# Altium project TemperatureController.PrjPcb (part 1 of 4)
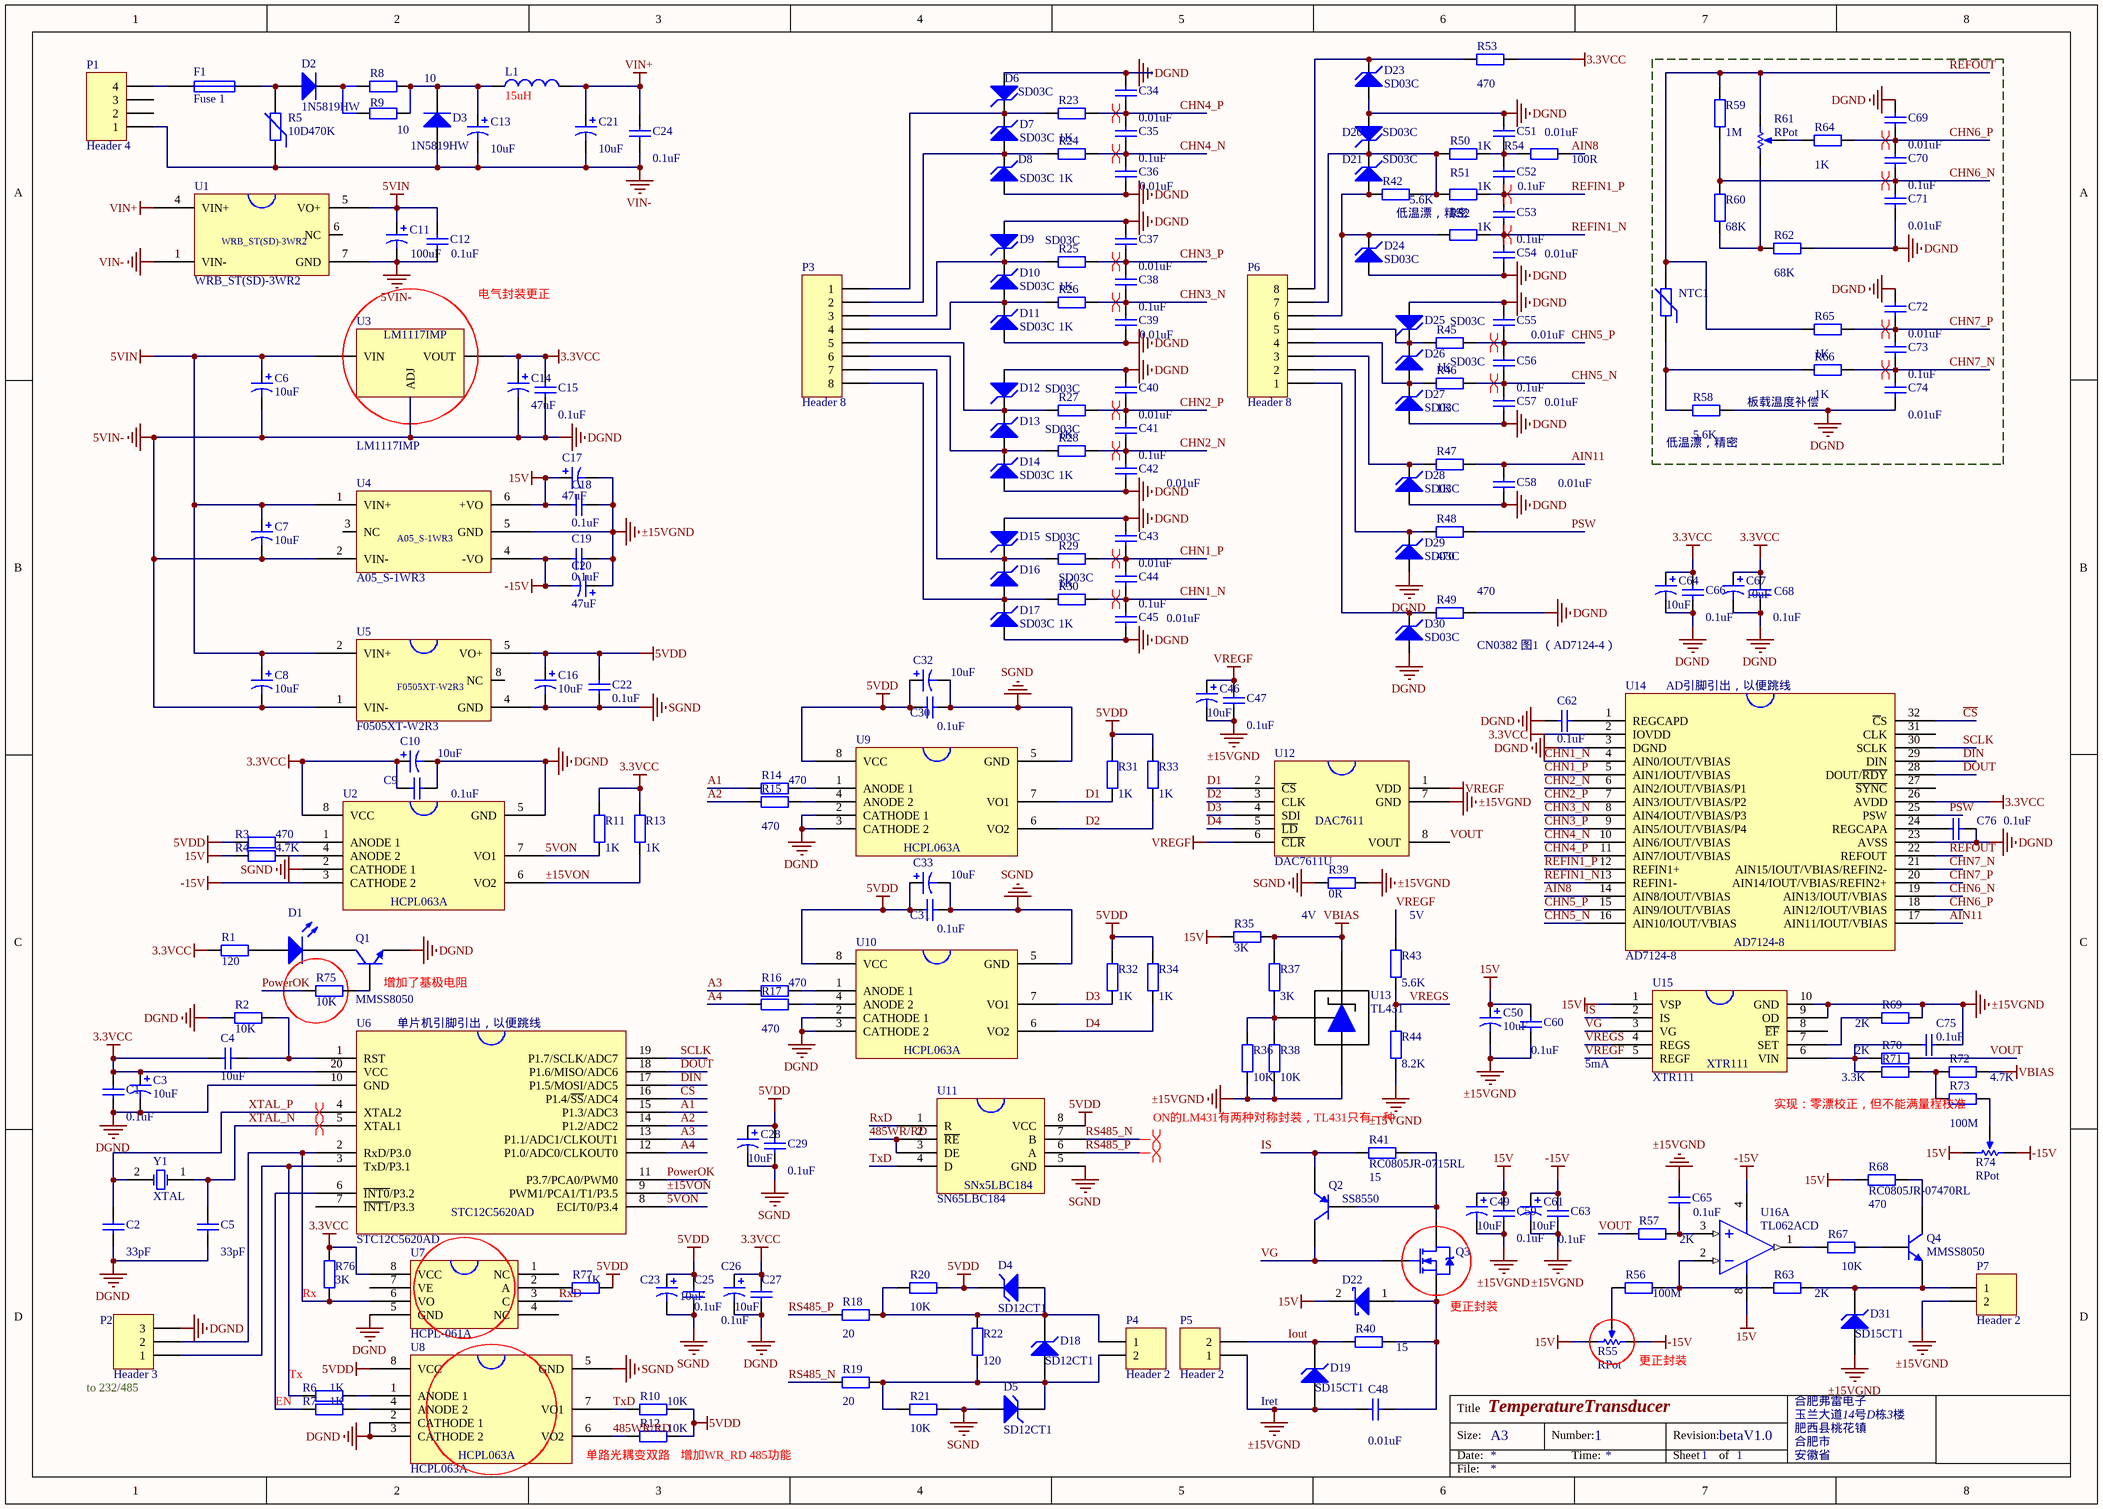
[diagram p0: betaV1.0.SchDoc]
18 sheets, 1029 parts. Net scope: hierarchical (ports join the sheet entries above them; power ports are global).
Board file: betaV1.0.PcbDoc
Sheets:
  betaV1.0.SchDoc
  dac.SchDoc
  relays.SchDoc
  rs485.SchDoc
  hmi.SchDoc
  iout.SchDoc
  viout.SchDoc
  infopage.SchDoc
    U_vioutchn1 = vioutchn1.SchDoc
    U_vioutchn2 = vioutchn2.SchDoc
    U_vioutchn3 = vioutchn3.SchDoc
    U_vioutchn4 = vioutchn4.SchDoc
    U_vioutchn5 = vioutchn5.SchDoc
    U_vioutchn6 = vioutchn6.SchDoc
    U_vioutchn7 = vioutchn7.SchDoc
    U_vioutchn8 = vioutchn8.SchDoc
    U_power = power.SchDoc
    U_mcu = mcu.SchDoc

## Sheet betaV1.0.SchDoc: TemperatureTransducer
size A3; Author: wq; DrawnBy: wq; Organization: 合肥弗雷电子; Address1: 玉兰大道14号D栋3楼; Address2: 肥西县桃花镇; Address3: 合肥市; Address4: 安徽省; DocumentNumber: 1; Revision: betaV1.0; SheetNumber: 1; SheetTotal: 1

### Parts
(Parts that share a designator on the sheet are numbered #1, #2 ... from top to bottom, then left to right.)
C1#1  value 0.1uF  [0805c]  (hidden comment: CC0805MRX7R9BB104)
C2#1  value 33pF  [0805c]  (hidden comment: CC0805MRX7R9BB330)
C3#1  value 10uF  [CB]  (hidden comment: T494B106M006AHAUTO)
C4#1  value 10uF  [0805c]  (hidden comment: CC0805MRX7R9BB106)
C5#1  value 33pF  [0805c]  (hidden comment: CC0805MRX7R9BB330)
C6#1  value 10uF  [CB]  (hidden comment: T494B106M006AHAUTO)
C7#1  value 10uF  [CB]  (hidden comment: T494B106M006AHAUTO)
C8#1  value 10uF  [CB]  (hidden comment: T494B106M006AHAUTO)
C9#1  value 0.1uF  [0805c]  (hidden comment: CC0805MRX7R9BB104)
C10#1  value 10uF  [CB]  (hidden comment: T494B106M006AHAUTO)
C11#1  value 100uF  [CB]  (hidden comment: T494B107M006AHAUTO)
C12#1  value 0.1uF  [0805c]  (hidden comment: CC0805MRX7R9BB104)
C13#1  value 10uF  [Φ6.3×11.5]  (hidden comment: ECR1HQG100M-063007)
C14#1  value 47uF  [CB]  (hidden comment: T494B476M010AHAUTO)
C15#1  value 0.1uF  [0805c]  (hidden comment: CC0805MRX7R9BB104)
C16#1  value 10uF  [CB]  (hidden comment: T494B106M006AHAUTO)
C17#1  value 47uF  [CB]  (hidden comment: T494B476K025ATAUTO)
C18#1  value 0.1uF  [0805c]  (hidden comment: CC0805MRX7R9BB104)
C19#1  value 0.1uF  [0805c]  (hidden comment: CC0805MRX7R9BB104)
C20#1  value 47uF  [CB]  (hidden comment: T494B476K025ATAUTO)
C21#1  value 10uF  [Φ6.3×11.5]  (hidden comment: ECR1HQG100M-063007)
C22#1  value 0.1uF  [0805c]  (hidden comment: CC0805MRX7R9BB104)
C23#1  value 10uF  [CB]  (hidden comment: T494B106M006AHAUTO)
C24#1  value 0.1uF  [0805c]  (hidden comment: CC0805MRX7R9BB104)
C25#1  value 0.1uF  [0805c]  (hidden comment: CC0805MRX7R9BB104)
C26#1  value 10uF  [CB]  (hidden comment: T494B106M006AHAUTO)
C27#1  value 0.1uF  [0805c]  (hidden comment: CC0805MRX7R9BB104)
C28#1  value 10uF  [CB]  (hidden comment: T494B106M006AHAUTO)
C29#1  value 0.1uF  [0805c]  (hidden comment: CC0805MRX7R9BB104)
C30#1  value 0.1uF  [0805c]  (hidden comment: CC0805MRX7R9BB104)
C31#1  value 0.1uF  [0805c]  (hidden comment: CC0805MRX7R9BB104)
C32#1  value 10uF  [CB]  (hidden comment: T494B106M006AHAUTO)
C33#1  value 10uF  [CB]  (hidden comment: T494B106M006AHAUTO)
C34#1  value 0.01uF  [0805c]  (hidden comment: CC0805MRX7R9BB103)
C35#1  value 0.1uF  [0805c]  (hidden comment: CC0805MRX7R9BB104)
C36#1  value 0.01uF  [0805c]  (hidden comment: CC0805MRX7R9BB103)
C37#1  value 0.01uF  [0805c]  (hidden comment: CC0805MRX7R9BB103)
C38#1  value 0.1uF  [0805c]  (hidden comment: CC0805MRX7R9BB104)
C39#1  value 0.01uF  [0805c]  (hidden comment: CC0805MRX7R9BB103)
C40#1  value 0.01uF  [0805c]  (hidden comment: CC0805MRX7R9BB103)
C41#1  value 0.1uF  [0805c]  (hidden comment: CC0805MRX7R9BB104)
C42#1  value 0.01uF  [0805c]  (hidden comment: CC0805MRX7R9BB103)
C43#1  value 0.01uF  [0805c]  (hidden comment: CC0805MRX7R9BB103)
C44#1  value 0.1uF  [0805c]  (hidden comment: CC0805MRX7R9BB104)
C45#1  value 0.01uF  [0805c]  (hidden comment: CC0805MRX7R9BB103)
C46#1  value 10uF  [CB]  (hidden comment: T494B106M006AHAUTO)
C47#1  value 0.1uF  [0805c]  (hidden comment: CC0805MRX7R9BB104)
C48#1  value 0.01uF  [0805c]  (hidden comment: CC0805MRX7R9BB103)
C49#1  value 10uF  [CB]  (hidden comment: T494B106M025AHAUTO)
C50#1  value 10uF  [CB]  (hidden comment: T494B106M025AHAUTO)
C51#1  value 0.01uF  [0805c]  (hidden comment: CC0805MRX7R9BB103)
C52#1  value 0.1uF  [0805c]  (hidden comment: CC0805MRX7R9BB104)
C53#1  value 0.1uF  [0805c]  (hidden comment: CC0805MRX7R9BB104)
C54#1  value 0.01uF  [0805c]  (hidden comment: CC0805MRX7R9BB103)
C55#1  value 0.01uF  [0805c]  (hidden comment: CC0805MRX7R9BB103)
C56#1  value 0.1uF  [0805c]  (hidden comment: CC0805MRX7R9BB104)
C57#1  value 0.01uF  [0805c]  (hidden comment: CC0805MRX7R9BB103)
C58#1  value 0.01uF  [0805c]  (hidden comment: CC0805MRX7R9BB103)
C59#1  value 0.1uF  [0805c]  (hidden comment: CC0805MRX7R9BB104)
C60#1  value 0.1uF  [0805c]  (hidden comment: CC0805MRX7R9BB104)
C61#1  value 10uF  [CB]  (hidden comment: T494B106M025AHAUTO)
C62#1  value 0.1uF  [0805c]  (hidden comment: CC0805MRX7R9BB104)
C63#1  value 0.1uF  [0805c]  (hidden comment: CC0805MRX7R9BB104)
C64#1  value 10uF  [CB]  (hidden comment: T494B106M006AHAUTO)
C65#1  value 0.1uF  [0805c]  (hidden comment: CC0805MRX7R9BB104)
C66#1  value 0.1uF  [0805c]  (hidden comment: CC0805MRX7R9BB104)
C67#1  value 10uF  [CB]  (hidden comment: T494B106M006AHAUTO)
C68#1  value 0.1uF  [0805c]  (hidden comment: CC0805MRX7R9BB104)
C69#1  value 0.01uF  [0805c]  (hidden comment: CC0805MRX7R9BB103)
C70#1  value 0.1uF  [0805c]  (hidden comment: CC0805MRX7R9BB104)
C71#1  value 0.01uF  [0805c]  (hidden comment: CC0805MRX7R9BB103)
C72#1  value 0.01uF  [0805c]  (hidden comment: CC0805MRX7R9BB103)
C73#1  value 0.1uF  [0805c]  (hidden comment: CC0805MRX7R9BB104)
C74#1  value 0.01uF  [0805c]  (hidden comment: CC0805MRX7R9BB103)
C75#1  value 0.1uF  [0805c]  (hidden comment: CC0805MRX7R9BB104)
C76#1  value 0.1uF  [0805c]  (hidden comment: CC0805MRX7R9BB104)
D1#1  150080GS75000  [LEDΦ3.0]  (value not drawn)
D2#1  1N5819HW  [sod123]
D3#1  1N5819HW  [sod123]
D4#1  SD12CT1  [sod323]
D5#1  SD12CT1  [sod323]
D6#1  SD03C  [sod323]
D7#1  SD03C  [sod323]
D8#1  SD03C  [sod323]
D9#1  SD03C  [sod323]
D10#1  SD03C  [sod323]
D11#1  SD03C  [sod323]
D12#1  SD03C  [sod323]
D13#1  SD03C  [sod323]
D14#1  SD03C  [sod323]
D15#1  SD03C  [sod323]
D16#1  SD03C  [sod323]
D17#1  SD03C  [sod323]
D18#1  SD12CT1  [sod323]
D19#1  SD15CT1  [sod323]
D20#1  SD03C  [sod323]
D21#1  SD03C  [sod323]
D22#1  RB160MM-50TF  [sod123]  (value not drawn)
D23#1  SD03C  [sod323]
D24#1  SD03C  [sod323]
D25#1  SD03C  [sod323]
D26#1  SD03C  [sod323]
D27#1  SD03C  [sod323]
D28#1  SD03C  [sod323]
D29#1  SD03C  [sod323]
D30#1  SD03C  [sod323]
D31#1  SD15CT1  [sod323]
F1#1  Fuse 1  [0805r]
L1#1  value 15uH  [vls4012]  (hidden comment: VLS4012HBX-150M)
NTC1#1  NTCS0805E3103JHT  [0805r]  (value not drawn)
P1#1  Header 4  [HDR1X4]
P2#1  Header 3  [HDR1X3]
P3#1  Header 8  [HDR1X8]
P4#1  Header 2  [HDR1X2]
P5#1  Header 2  [HDR1X2]
P6#1  Header 8  [HDR1X8]
P7#1  Header 2  [HDR1X2]
Q1#1  MMSS8050  [SOT-23-BJT]
Q2#1  SS8550  [SOT-23-BJT]
Q3#1  SI2309  [SOT-23-MOS]  (value not drawn)
Q4#1  MMSS8050  [SOT-23-BJT]
R1#1  value 120  [0805R]  (hidden comment: RC0805JR-07120RL)
R2#1  value 10K  [0805R]  (hidden comment: RC0805JR-0710KL)
R3#1  value 470  [0805R]  (hidden comment: RC0805JR-07470RL)
R4#1  value 4.7K  [0805R]  (hidden comment: RC0805JR-074700RL)
R5#1  10D470K  [mov]
R6#1  value 1K  [0805R]  (hidden comment: RC0805JR-071KL)
R7#1  value 1K  [0805R]  (hidden comment: RC0805JR-071KL)
R8#1  value 10  [0805R]  (hidden comment: PNP-200KJBJ26-10R)
R9#1  value 10  [0805R]  (hidden comment: PNP-200KJBJ26-10R)
R10#1  value 10K  [0805R]  (hidden comment: RC0805JR-0710KRL)
R11#1  value 1K  [0805R]  (hidden comment: RC0805JR-071KL)
R12#1  value 10K  [0805R]  (hidden comment: RC0805JR-0710KRL)
R13#1  value 1K  [0805R]  (hidden comment: RC0805JR-071KL)
R14#1  value 470  [0805R]  (hidden comment: RC0805JR-07470RL)
R15#1  value 470  [0805R]  (hidden comment: RC0805JR-07470RL)
R16#1  value 470  [0805R]  (hidden comment: RC0805JR-07470RL)
R17#1  value 470  [0805R]  (hidden comment: RC0805JR-07470RL)
R18#1  value 20  [0805R]  (hidden comment: RC0805JR-0720RL)
R19#1  value 20  [0805R]  (hidden comment: RC0805JR-0720RL)
R20#1  value 10K  [0805R]  (hidden comment: RC0805JR-0710KL)
R21#1  value 10K  [0805R]  (hidden comment: RC0805JR-0710KL)
R22#1  value 120  [0805R]  (hidden comment: RC0805JR-07120RL)
R23#1  value 1K  [0805R]  (hidden comment: RC0805JR-071KL)
R24#1  value 1K  [0805R]  (hidden comment: RC0805JR-071KL)
R25#1  value 1K  [0805R]  (hidden comment: RC0805JR-071KL)
R26#1  value 1K  [0805R]  (hidden comment: RC0805JR-071KL)
R27#1  value 1K  [0805R]  (hidden comment: RC0805JR-071KL)
R28#1  value 1K  [0805R]  (hidden comment: RC0805JR-071KL)
R29#1  value 1K  [0805R]  (hidden comment: RC0805JR-071KL)
R30#1  value 1K  [0805R]  (hidden comment: RC0805JR-071KL)
R31#1  value 1K  [0805R]  (hidden comment: RC0805JR-071KL)
R32#1  value 1K  [0805R]  (hidden comment: RC0805JR-071KL)
R33#1  value 1K  [0805R]  (hidden comment: RC0805JR-071KL)
R34#1  value 1K  [0805R]  (hidden comment: RC0805JR-071KL)
R35#1  value 3K  [0805R]  (hidden comment: RC0805JR-073KL)
R36#1  value 10K  [0805R]  (hidden comment: RC0805JR-0710KL)
R37#1  value 3K  [0805R]  (hidden comment: RC0805JR-073KL)
R38#1  value 10K  [0805R]  (hidden comment: RC0805JR-0710KL)
R39#1  value 0R  [0805R]  (hidden comment: RC0805JR-000KL)
R40#1  value 15  [0805R]  (hidden comment: RC0805JR-0715RL)
R41#1  RC0805JR-0715RL  value 15  [0805R]
R42#1  value 5.6K  [0805R]  (hidden comment: RC0805JR-075600RL)
R43#1  value 5.6K  [0805R]  (hidden comment: RC0805JR-075600RL)
R44#1  value 8.2K  [0805R]  (hidden comment: RC0805JR-078200RL)
R45#1  value 1K  [0805R]  (hidden comment: RC0805JR-071KL)
R46#1  value 1K  [0805R]  (hidden comment: RC0805JR-071KL)
R47#1  value 1K  [0805R]  (hidden comment: RC0805JR-071KL)
R48#1  value 470  [0805R]  (hidden comment: RC0805JR-07470RL)
R49#1  value 470  [0805R]  (hidden comment: RC0805JR-07470RL)
R50#1  value 1K  [0805R]  (hidden comment: RC0805JR-071KL)
R51#1  value 1K  [0805R]  (hidden comment: RC0805JR-071KL)
R52#1  value 1K  [0805R]  (hidden comment: RC0805JR-071KL)
R53#1  value 470  [0805R]  (hidden comment: RC0805JR-07470RL)
R54#1  value 100R  [0805R]  (hidden comment: RC0805JR-07100RL)
R55#1  RPot  [VR5]
R56#1  value 100M  [0805R]  (hidden comment: RC0805JR-07100ML)
R57#1  value 2K  [0805R]  (hidden comment: RC0805JR-072KL)
R58#1  value 5.6K  [0805R]  (hidden comment: RC0805JR-075600RL)
R59#1  value 1M  [0805R]  (hidden comment: RC0805JR-071000KL)
R60#1  value 68K  [0805R]  (hidden comment: RC0805JR-0768KL)
R61#1  RPot  [VR5]
R62#1  value 68K  [0805R]  (hidden comment: RC0805JR-0768KL)
R63#1  value 2K  [0805R]  (hidden comment: RC0805JR-072KL)
R64#1  value 1K  [0805R]  (hidden comment: RC0805JR-071KL)
R65#1  value 1K  [0805R]  (hidden comment: RC0805JR-071KL)
R66#1  value 1K  [0805R]  (hidden comment: RC0805JR-071KL)
R67#1  value 10K  [0805R]  (hidden comment: RC0805JR-0710KL)
R68#1  RC0805JR-07470RL  value 470  [0805R]
R69#1  value 2K  [0805R]  (hidden comment: RC0805JR-072KL)
R70#1  value 2K  [0805R]  (hidden comment: RC0805JR-072KL)
R71#1  value 3.3K  [0805R]  (hidden comment: RC0805JR-073300RL)
R72#1  value 4.7K  [0805R]  (hidden comment: RC0805JR-074700RL)
R73#1  value 100M  [0805R]  (hidden comment: RC0805JR-07100ML)
R74#1  RPot  [VR5]
R75#1  value 10K  [0805R]  (hidden comment: RC0805JR-0710KL)
R76#1  value 3K  [0805R]  (hidden comment: RC0805JR-073KL)
R77#1  value 1K  [0805R]  (hidden comment: RC0805JR-071KL)
U1#1  WRB_ST(SD)-3WR2  [WRB_ST(SD)-3WR2]
U2#1  HCPL063A  [SO-8-N]  (value not drawn)
U3#1  LM1117IMP  [SOT223_M]
U4#1  A05_S-1WR3  [A05_S-1WR3]
U5#1  F0505XT-W2R3  [F0505XT-W2R3]
U6#1  STC12C5620AD  [SOP20]
U7#1  HCPL-061A  [SO-8-N]
U8#1  HCPL063A  [SO-8-N]
U9#1  HCPL063A  [SO-8-N]  (value not drawn)
U10#1  HCPL063A  [SO-8-N]  (value not drawn)
U11#1  SN65LBC184  [so-8-n]
U12#1  DAC7611U  [so-8-n]
U13#1  TL431  [SOT-23-3]
U14#1  AD7124-8  [TI-RHB32-3150X3150TP_V]
U15#1  XTR111  [S-PDSO-G10]
U16#1  TL062ACD  [so-8-n]  (part A of 2)
Y1#1  XTAL  [11.0592MHz]

### Nets
3.3VCC: C1#1.1 C3#1.1 C4#1.1 C9#1.1 C10#1.1 C14#1.1 C15#1.1 C26#1.1 C27#1.1 C64#1.1 C66#1.1 C67#1.1 C68#1.1 R1#1.1 R11#1.1 R13#1.1 R53#1.1 R76#1.2 U2#1.8(VCC) U3#1.2(VOUT) U6#1.20(VCC) U7#1.8(VCC) U14#1.2(IOVDD) U14#1.26(AVDD)
5VDD: C16#1.1 C22#1.2 C23#1.1 C25#1.1 C28#1.1 C29#1.1 C30#1.1 C31#1.1 C32#1.1 C33#1.1 D4#1.2(K) R3#1.2 R10#1.1 R12#1.1 R20#1.1 R31#1.1 R32#1.1 R33#1.1 R34#1.1 R77#1.1 U5#1.5(VO+) U8#1.8(VCC) U9#1.8(VCC) U10#1.8(VCC) U11#1.8(VCC)
5VIN: C6#1.1 C7#1.1 C8#1.1 C11#1.1 C12#1.2 U1#1.5(VO+) U3#1.3(VIN) U4#1.1(VIN+) U5#1.2(VIN+)
5VIN-: C1#1.2 C2#1.2 C3#1.2 C5#1.2 C6#1.2 C7#1.2 C8#1.2 C9#1.2 C10#1.2 C11#1.2 C12#1.1 C14#1.2 C15#1.2 C26#1.2 C27#1.2 C34#1.2 C36#1.2 C37#1.2 C39#1.2 C40#1.2 C42#1.2 C43#1.2 C45#1.2 C51#1.2 C54#1.2 C55#1.2 C57#1.2 C58#1.2 C62#1.1 C64#1.2 C66#1.2 C67#1.2 C68#1.2 C69#1.2 C71#1.2 C72#1.2 C74#1.2 C76#1.1 D6#1.1(ANODE) D8#1.1(ANODE) D9#1.1(ANODE) D11#1.1(ANODE) D12#1.1(ANODE) D14#1.1(ANODE) D15#1.1(ANODE) D17#1.1(ANODE) D20#1.1(ANODE) D23#1.1(ANODE) D24#1.1(ANODE) D25#1.1(ANODE) D27#1.1(ANODE) D28#1.1(ANODE) D29#1.1(ANODE) D30#1.1(ANODE) P2#1.3 Q1#1.3(E) R2#1.1 R49#1.1 R58#1.1 R62#1.1 U1#1.7(GND) U2#1.5(GND) U3#1.1(ADJ) U4#1.2(VIN-) U5#1.1(VIN-) U6#1.10(GND) U7#1.5(GND) U8#1.2(CATHODE_1) U8#1.3(CATHODE_2) U9#1.2(CATHODE_1) U9#1.3(CATHODE_2) U10#1.2(CATHODE_1) U10#1.3(CATHODE_2) U14#1.3(DGND) U14#1.23(AVSS)  [also labelled DGND]
15V: C17#1.1 C18#1.1 C49#1.1 C50#1.1 C59#1.2 C60#1.2 D22#1.2(K) R4#1.2 R35#1.1 R55#1.1(BOT) R68#1.1 R74#1.1(BOT) U4#1.6(+VO) U15#1.1(VSP) U16#1.8(VCC+)
-15V: C19#1.1 C20#1.2 C61#1.1 C63#1.2 R55#1.3(TOP) R74#1.3(TOP) U2#1.3(CATHODE_2) U4#1.4(-VO) U16#1.4(VCC-)
SGND: C16#1.2 C22#1.1 C23#1.2 C25#1.2 C28#1.2 C29#1.2 C30#1.2 C31#1.2 C32#1.2 C33#1.2 D5#1.1(A) R21#1.1 R39#1.1 U2#1.2(CATHODE_1) U5#1.4(GND) U8#1.5(GND) U9#1.5(GND) U10#1.5(GND) U11#1.5(GND)
VBIAS: R35#1.2 R37#1.1 R72#1.1 U13#1.1(CATHODE)
VIN+: C21#1.1 C24#1.1 L1#1.2 U1#1.4(VIN+)
VIN-: C13#1.2 C21#1.2 C24#1.2 D3#1.1(A) P1#1.1 R5#1.1 U1#1.1(VIN-)
VREGF: C46#1.1 C47#1.2 R43#1.1 U12#1.1(VDD) U12#1.6(~{CLR}) U15#1.5(REGF)
±15VGND: C17#1.2 C18#1.2 C19#1.2 C20#1.1 C46#1.2 C47#1.1 C48#1.2 C49#1.2 C50#1.2 C59#1.1 C60#1.1 C61#1.2 C63#1.1 C65#1.2 C75#1.1 D19#1.1(A) D31#1.1(A) P5#1.1 P7#1.2 R36#1.2 R38#1.2 R39#1.2 R44#1.2 R69#1.1 U4#1.5(GND) U12#1.7(GND) U13#1.3(ANODE) U15#1.9(OD) U15#1.10(GND)
5VON: R11#1.2 U2#1.7(VO1) U6#1.8(ECI/T0/P3.4)
485WR/RD: R12#1.2 U8#1.6(VO2) U11#1.2(~{RE}) U11#1.3(DE)
A1: R14#1.2 U6#1.15(P1.3/ADC3)
A2: R15#1.2 U6#1.14(P1.2/ADC2)
A3: R16#1.2 U6#1.13(P1.1/ADC1/CLKOUT1)
A4: R17#1.2 U6#1.12(P1.0/ADC0/CLKOUT0)
AIN8: R54#1.1 U14#1.14(AIN8/IOUT/VBIAS)
AIN11: C58#1.1 R47#1.1 U14#1.17(AIN11/IOUT/VBIAS)
~{CS}: U6#1.16(P1.4/~{SS}/ADC4) U14#1.32(~{C}S)
CHN1_N: C44#1.2 C45#1.1 R30#1.1 U14#1.4(AIN0/IOUT/VBIAS)
CHN1_P: C43#1.1 C44#1.1 R29#1.1 U14#1.5(AIN1/IOUT/VBIAS)
CHN2_N: C41#1.2 C42#1.1 R28#1.1 U14#1.6(AIN2/IOUT/VBIAS/P1)
CHN2_P: C40#1.1 C41#1.1 R27#1.1 U14#1.7(AIN3/IOUT/VBIAS/P2)
CHN3_N: C38#1.2 C39#1.1 R26#1.1 U14#1.8(AIN4/IOUT/VBIAS/P3)
CHN3_P: C37#1.1 C38#1.1 R25#1.1 U14#1.9(AIN5/IOUT/VBIAS/P4)
CHN4_N: C35#1.2 C36#1.1 R24#1.1 U14#1.10(AIN6/IOUT/VBIAS)
CHN4_P: C34#1.1 C35#1.1 R23#1.1 U14#1.11(AIN7/IOUT/VBIAS)
CHN5_N: C56#1.2 C57#1.1 R46#1.1 U14#1.16(AIN10/IOUT/VBIAS)
CHN5_P: C55#1.1 C56#1.1 R45#1.1 U14#1.15(AIN9/IOUT/VBIAS)
CHN6_N: C70#1.2 C71#1.1 R59#1.2 R60#1.1 U14#1.19(AIN13/IOUT/VBIAS)
CHN6_P: C69#1.1 C70#1.1 R64#1.1 U14#1.18(AIN12/IOUT/VBIAS)
CHN7_N: C73#1.2 C74#1.1 R66#1.1 U14#1.21(AIN15/IOUT/VBIAS/REFIN2-)
CHN7_P: C72#1.1 C73#1.1 R65#1.1 U14#1.20(AIN14/IOUT/VBIAS/REFIN2+)
D1: R31#1.2 U9#1.7(VO1) U12#1.2(~{CS})
D2: R33#1.2 U9#1.6(VO2) U12#1.3(CLK)
D3: R32#1.2 U10#1.7(VO1) U12#1.4(SDI)
D4: R34#1.2 U10#1.6(VO2) U12#1.5(~{LD})
DIN: U6#1.17(P1.5/MOSI/ADC5) U14#1.29(DIN)
DOUT: U6#1.18(P1.6/MISO/ADC6) U14#1.28(DOUT/~{RDY})
Iout: D19#1.2(K) P5#1.2 R40#1.1
IS: Q2#1.3(E) R41#1.2 U15#1.2(IS)
PowerOK: R75#1.1 U6#1.11(P3.7/PCA0/PWM0)
PSW: R48#1.1 U14#1.25(PSW)
REFIN1_N: C53#1.2 C54#1.1 R52#1.1 U14#1.13(REFIN1-)
REFIN1_P: C52#1.1 C53#1.1 R51#1.1 U14#1.12(REFIN1+)
REFOUT: NTC1#1.2 R59#1.1 R61#1.1(BOT) R65#1.2 U14#1.22(REFOUT)
RS485_N: R19#1.2 U11#1.7(B)
RS485_P: R18#1.1 U11#1.6(A)
RxD: U7#1.3(C) U11#1.1(R)
SCLK: U6#1.19(P1.7/SCLK/ADC7) U14#1.30(SCLK)
TxD: R10#1.2 U8#1.7(VO1) U11#1.4(D)
VG: Q2#1.1(C) Q3#1.1(G) U15#1.3(VG)
VOUT: R57#1.2 R70#1.1 U12#1.8(VOUT)
VREGS: R43#1.2 R44#1.1 U15#1.4(REGS)
XTAL_N: C5#1.1 U6#1.5(XTAL1) Y1#1.1(OSC1)
XTAL_P: C2#1.1 U6#1.4(XTAL2) Y1#1.2(OSC2)
±15VON: R13#1.2 U2#1.6(VO2) U6#1.9(PWM1/PCA1/T1/P3.5)
NetC4#1_2: C4#1.2 R2#1.2 U6#1.1(RST)
NetC13#1_1: C13#1.1 D3#1.2(K) L1#1.1 R8#1.1 R9#1.1
NetC48#1_1: C48#1.1 D22#1.1(A) Q3#1.3(S) R40#1.2
NetC51#1_1: C51#1.1 C52#1.2 R50#1.1 R54#1.2
NetC62#1_2: C62#1.2 U14#1.1(REGCAPD)
NetC65#1_1: C65#1.1 R57#1.1 U16#1.3(IN1+)
NetC75#1_2: C75#1.2 R70#1.2 R71#1.2 U15#1.6(VIN)
NetC76#1_2: C76#1.2 U14#1.24(REGCAPA)
NetD1#1_1: D1#1.1(A) R1#1.2
NetD1#1_2: D1#1.2(K) Q1#1.1(C)
NetD2#1_1: D2#1.1(A) F1#1.2 R5#1.2
NetD2#1_2: D2#1.2(K) R8#1.2 R9#1.2
NetD4#1_1: D4#1.1(A) D18#1.2(K) P4#1.1 R18#1.2 R20#1.2 R22#1.2
NetD5#1_2: D5#1.2(K) D18#1.1(A) P4#1.2 R19#1.1 R21#1.2 R22#1.1
NetD6#1_2: D6#1.2(CATHODE) D7#1.2(CATHODE) P3#1.1 R23#1.2
NetD7#1_1: D7#1.1(ANODE) D8#1.2(CATHODE) P3#1.2 R24#1.2
NetD9#1_2: D9#1.2(CATHODE) D10#1.2(CATHODE) P3#1.3 R25#1.2
NetD10#1_1: D10#1.1(ANODE) D11#1.2(CATHODE) P3#1.4 R26#1.2
NetD12#1_2: D12#1.2(CATHODE) D13#1.2(CATHODE) P3#1.5 R27#1.2
NetD13#1_1: D13#1.1(ANODE) D14#1.2(CATHODE) P3#1.6 R28#1.2
NetD15#1_2: D15#1.2(CATHODE) D16#1.2(CATHODE) P3#1.7 R29#1.2
NetD16#1_1: D16#1.1(ANODE) D17#1.2(CATHODE) P3#1.8 R30#1.2
NetD20#1_2: D20#1.2(CATHODE) D21#1.2(CATHODE) P6#1.7 R42#1.2 R50#1.2 R51#1.2
NetD21#1_1: D21#1.1(ANODE) D24#1.2(CATHODE) P6#1.6 R42#1.1 R52#1.2
NetD23#1_2: D23#1.2(CATHODE) P6#1.8 R53#1.2
NetD25#1_2: D25#1.2(CATHODE) D26#1.2(CATHODE) P6#1.5 R45#1.2
NetD26#1_1: D26#1.1(ANODE) D27#1.2(CATHODE) P6#1.4 R46#1.2
NetD28#1_2: D28#1.2(CATHODE) P6#1.3 R47#1.2
NetD29#1_2: D29#1.2(CATHODE) P6#1.2 R48#1.2
NetD30#1_2: D30#1.2(CATHODE) P6#1.1 R49#1.2
NetD31#1_2: D31#1.2(K) P7#1.1 Q4#1.3(E) R63#1.1
NetF1#1_1: F1#1.1 P1#1.4
NetNTC1#1_1: NTC1#1.1 R58#1.2 R66#1.2
NetP2#1_1: P2#1.1 R6#1.2 U6#1.3(TxD/P3.1)
NetP2#1_2: P2#1.2 R76#1.1 U6#1.2(RxD/P3.0) U7#1.6(VO)
NetQ1#1_2: Q1#1.2(B) R75#1.2
NetQ2#1_2: Q2#1.2(B) Q3#1.2(D) R41#1.1
NetQ4#1_1: Q4#1.1(C) R68#1.2
NetQ4#1_2: Q4#1.2(B) R67#1.1
NetR3#1_1: R3#1.1 U2#1.1(ANODE_1)
NetR4#1_1: R4#1.1 U2#1.4(ANODE_2)
NetR6#1_1: R6#1.1 U8#1.1(ANODE_1)
NetR7#1_1: R7#1.1 U8#1.4(ANODE_2)
NetR7#1_2: R7#1.2 U6#1.6(~{INT0}/P3.2)
NetR14#1_1: R14#1.1 U9#1.1(ANODE_1)
NetR15#1_1: R15#1.1 U9#1.4(ANODE_2)
NetR16#1_1: R16#1.1 U10#1.1(ANODE_1)
NetR17#1_1: R17#1.1 U10#1.4(ANODE_2)
NetR36#1_1: R36#1.1 R37#1.2 R38#1.1 U13#1.2(REF)
NetR55#1_2: R55#1.2(TAP) R56#1.2
NetR56#1_1: R56#1.1 R63#1.2 U16#1.2(IN1-)
NetR60#1_2: R60#1.2 R61#1.3(TOP) R62#1.2
NetR61#1_2: R61#1.2(TAP) R64#1.2
NetR67#1_2: R67#1.2 U16#1.1(OUT1)
NetR69#1_2: R69#1.2 U15#1.7(SET)
NetR71#1_1: R71#1.1 R72#1.2 R73#1.1
NetR73#1_2: R73#1.2 R74#1.2(TAP)
NetR77#1_2: R77#1.2 U7#1.2(A)

Not connected (* = marked no-connect by the designer): P1#1 2 3; U1#1 6(NC); U4#1 3(NC); U5#1 8(NC); U6#1 7(~{INT1}/P3.3); U7#1 1(NC) 4(NC) 7(VE); U14#1 27(~{SYNC}) 31(CLK); U15#1 8(~{EF})

### Layout directives
differential pair; differential pair class *: CHN1_P
differential pair: CHN1_N, CHN2_N, CHN2_P, CHN3_N, CHN3_P, CHN4_N, CHN4_P, CHN5_N, CHN5_P, CHN6_N, CHN6_P, CHN7_N, CHN7_P, REFIN1_N, REFIN1_P, RS485_N, RS485_P, XTAL_N, XTAL_P

### Notes on the sheet
- 低温漂，精密
- 电气封装更正
- (near R58#1) 低温漂，精密
- 板载温度补偿
- (near R49#1) CN0382 图1 （AD7124-4）
- (near U14#1) AD引脚引出，以便跳线
- 4V
- (near R43#1) 5V
- (near Q1#1) 增加了基极电阻
- (near U6#1) 单片机引脚引出，以便跳线
- ON的LM431有两种对称封装，TL431只有一种
- 5mA
- 实现：零漂校正，但不能满量程校准
- (near R76#1) Rx
- (near Q3#1) 更正封装
- (near P2#1) to 232/485
- Tx
- (near R55#1) 更正封装
- EN
- 单路光耦变双路
- (near R12#1) 增加WR_RD 485功能
- (near D19#1) Iret
- Title
- Size:
- Date:
- A3
- Number:
- Time:
- Revision:
- Sheet
- of
- File:

### Library data of the parts
C1#1 C2#1 C4#1 C5#1 C9#1 C12#1 C15#1 C18#1 C19#1 C22#1 C24#1 C25#1 C27#1 C29#1 C30#1 C31#1 C34#1 C35#1 C36#1 C37#1 C38#1 C39#1 C40#1 C41#1 C42#1 C43#1 C44#1 C45#1 C47#1 C48#1 C51#1 C52#1 C53#1 C54#1 C55#1 C56#1 C57#1 C58#1 C59#1 C60#1 C62#1 C63#1 C65#1 C66#1 C68#1 C69#1 C70#1 C71#1 C72#1 C73#1 C74#1 C75#1 C76#1 = Cap: Capacitor
  C2#1 C5#1 C9#1 C12#1 C15#1 C18#1 C19#1 C22#1 C24#1 C25#1 C27#1 C29#1 C30#1 C31#1 C34#1 C35#1 C36#1 C37#1 C38#1 C39#1 C40#1 C41#1 C42#1 C43#1 C44#1 C45#1 C47#1 C48#1 C51#1 C52#1 C53#1 C54#1 C55#1 C56#1 C57#1 C58#1 C59#1 C60#1 C62#1 C63#1 C65#1 C66#1 C68#1 C69#1 C70#1 C71#1 C72#1 C73#1 C74#1 C75#1 C76#1: Published: 8-Jun-2000; LatestRevisionDate: 17-Jul-2002; LatestRevisionNote: Re-released for DXP Platform.; PackageReference: RAD-0.3; Publisher: Altium Limited; PackageDescription: Radial Cap, Thru-Hole; 2 Leads; 0.3 in Pin Spacing
C3#1 C6#1 C7#1 C8#1 C10#1 C11#1 C13#1 C14#1 C16#1 C17#1 C20#1 C21#1 C23#1 C26#1 C28#1 C32#1 C33#1 C46#1 C49#1 C50#1 C61#1 C64#1 C67#1 = Cap Pol1: Polarized Capacitor (Radial); Published: 8-Jun-2000; LatestRevisionDate: 17-Jul-2002; LatestRevisionNote: Re-released for DXP Platform.; PackageReference: RB7.6-15; Publisher: Altium Limited; PackageDescription: Polarized Capacitor (Radial); 2 Leads
D1#1 = LED2: Typical RED, GREEN, YELLOW, AMBER GaAs LED; Published: 8-Jun-2000; LatestRevisionDate: 17-Jul-2002; LatestRevisionNote: Re-released for DXP Platform.; PackageVersion: Feb-2002; PackageReference: 3.2X1.6X1.1; Publisher: Altium Limited; PackageDescription: SM LED; 2 Flat Leads
D2#1 D3#1 = Diode: Default Diode; Published: 8-Jun-2000; LatestRevisionDate: 17-Jul-2002; LatestRevisionNote: Re-released for DXP Platform.; PackageVersion: Sep-1996; PackageReference: SMC; Publisher: Altium Limited; PackageDescription: DO-214-AB/SMC; 2 C-Bend Leads; Body 7.9 x 5.9 mm, inc. leads (LxW); Code_JEDEC: DO-214-AB
D4#1 D5#1 D18#1 D19#1 D31#1 = D Zener: Zener Diode; Published: 8-Jun-2000; LatestRevisionDate: 17-Jul-2002; LatestRevisionNote: Re-released for DXP Platform.; PackageReference: DIODE-0.7; Publisher: Altium Limited; PackageDescription: Diode, Thru-Hole; 2 Leads; 0.7 in Pin Spacing
D6#1 D7#1 D8#1 D9#1 D10#1 D11#1 D12#1 D13#1 D14#1 D15#1 D16#1 D17#1 D20#1 D21#1 D23#1 D24#1 D25#1 D26#1 D27#1 D28#1 D29#1 D30#1 = TVS DIODE
D22#1 = D Schottky: Schottky Diode; Published: 8-Jun-2000; LatestRevisionDate: 17-Jul-2002; LatestRevisionNote: Re-released for DXP Platform.; PackageReference: SMB; Publisher: Altium Limited; PackageDescription: DO-214-AA/SMB; 2 C-Bend Leads; Body 5.3 x 3.6 mm, inc. leads (LxW); Code_JEDEC: DO-214-AA
F1#1 = Fuse 1: Fuse; Published: 8-Jun-2000; LatestRevisionDate: 17-Jul-2002; LatestRevisionNote: Re-released for DXP Platform.; PackageReference: PIN-W2/E2.8; Publisher: Altium Limited; PackageDescription: Thru-Hole; 2 Leads
L1#1 = Inductor
NTC1#1 R5#1 = Res Varistor: Varistor (Voltage-Sensitive Resistor); Published: 24-Mar-1999; LatestRevisionDate: 29-May-2009; LatestRevisionNote: IPC-7351 Footprint Added.; PackageVersion: Mar-2003; PackageReference: 6-0805; Publisher: Altium Limited; PackageDescription: Chip Resistor 0805 Case Size; Code_IPC: RESC2012
P1#1 = Header 4: Header, 4-Pin; LatestRevisionDate: 17-Jul-2002; LatestRevisionNote: Re-released for DXP Platform.; Publisher: Altium Limited
P2#1 = Header 3: Header, 3-Pin; LatestRevisionDate: 17-Jul-2002; LatestRevisionNote: Re-released for DXP Platform.; Publisher: Altium Limited
P3#1 P6#1 = Header 8: Header, 8-Pin; LatestRevisionDate: 17-Jul-2002; LatestRevisionNote: Re-released for DXP Platform.; Publisher: Altium Limited
P4#1 P5#1 P7#1 = Header 2: Header, 2-Pin; LatestRevisionDate: 17-Jul-2002; LatestRevisionNote: Re-released for DXP Platform.; Publisher: Altium Limited
Q1#1 Q4#1 = NPN: NPN Bipolar Transistor; Published: 8-Jun-2000; LatestRevisionDate: 17-Jul-2002; LatestRevisionNote: Re-released for DXP Platform.; PackageReference: TO-226-AA; Publisher: Altium Limited; PackageDescription: TO, Flat Index; 3 In-Line, Axial Leads; Body Dia. 4.8mm; Leads 0.55 x 0.51 mm (max); Code_JEDEC: TO-226-AA
Q2#1 = PNP: PNP Bipolar Transistor; Published: 8-Jun-2000; LatestRevisionDate: 29-May-2009; LatestRevisionNote: IPC-7351 Footprint Added.; PackageVersion: Aug-1999; PackageReference: SOT-23B; Publisher: Altium Limited; PackageDescription: 3-Pin SOT-23 Package 0.95 mm Pitch, 2.4 mm Lead Span
Q3#1 = NMOS-2: N-Channel Power MOSFET; Note: Pin 2 is electrically connected to pin 4.; Published: 8-Jun-2000; LatestRevisionDate: 17-Jul-2002; LatestRevisionNote: Re-released for DXP Platform.; DatasheetVersion: PD-9.814; PackageVersion: Feb-1997; PackageReference: TO-220AB; Publisher: Altium Limited; PackageDescription: TO, Thru-Hole, Vertical, Heatsink Mounted; 3 In-Line Leads; Pitch 2.54 mm; ComponentLink1Description: Manufacturer Link; ComponentLink1URL: http://www.irf.com/
R1#1 R2#1 R3#1 R4#1 R6#1 R7#1 R8#1 R9#1 R10#1 R11#1 R12#1 R13#1 R14#1 R15#1 R16#1 R17#1 R18#1 R19#1 R20#1 R21#1 R22#1 R23#1 R24#1 R25#1 R26#1 R27#1 R28#1 R29#1 R30#1 R31#1 R32#1 R33#1 R34#1 R35#1 R36#1 R37#1 R38#1 R39#1 R40#1 R41#1 R42#1 R43#1 R44#1 R45#1 R46#1 R47#1 R48#1 R49#1 R50#1 R51#1 R52#1 R53#1 R54#1 R56#1 R57#1 R58#1 R59#1 R60#1 R62#1 R63#1 R64#1 R65#1 R66#1 R67#1 R68#1 R69#1 R70#1 R71#1 R72#1 R73#1 R75#1 R76#1 R77#1 = Res2: Resistor; Published: 8-Jun-2000; LatestRevisionDate: 17-Jul-2002; LatestRevisionNote: Re-released for DXP Platform.; PackageReference: AXIAL-0.4; Publisher: Altium Limited; PackageDescription: Axial Device, Thru-Hole; 2 Leads; 0.4 in Pin Spacing
R55#1 R61#1 R74#1 = RPot: Potentiometer; Sim Note: Enter the Resistance value and the set point into parameter fields.; Set Position: 0.5; Value: 1K; Published: 8-Jun-2000; LatestRevisionDate: 17-Jul-2002; LatestRevisionNote: Re-released for DXP Platform.; PackageReference: VR5; Publisher: Altium Limited; PackageDescription: Variable Resistor, Thru-Hole; 3 Leads
U7#1 = 6N137
U11#1 = SNx5LBC184
U12#1 = DAC7611
U16#1 = TL062ACD: Low-Power JFET-Input Operational Amplifier, 7 to 36 V, 0 to 70 degC, 8-pin SOIC (D8), Green (RoHS & no Sb/Br); Manufacturer: Texas Instruments; CMRR(Min)(dB): 80; GBW(Typ)(MHz): 1; IIB(Max)(pA): 200; Iq per channel(Max)(mA): 0.25; Number of Channels: 2; Offset Drift(Typ)(uV/C): 10; Rating: Catalog; Slew Rate(Typ)(V/us): 3.5; Sub Family: General Purpose Amplifier, High Supply Voltage Amplifier (>=30V), Low Power Amp (<=500uA); Total Supply Voltage(Max)(+5V is 5, +/-5V is 10): 36; Total Supply Voltage(Min)(+5V is 5, +/-5V is 10): 7; Vio (25C)(Max)(mV): 6; Vn at 1kHz(Typ)(nV/rtHz): 42; DatasheetVersion: SLOS078J; PackageVersion: 4040047-3/M, 06/2011; PackageReference: D8; PackageDescription: 8-Pin Plastic Small Outline, Body 4.9 x 3.9 mm, Pitch 1.27 mm; Supplier 1: Digi-Key; Supplier Part Number 1: 296-7175-5-ND; Supplier 2: Farnell; Supplier Part Number 2: 9593241; Supplier 3: Newark; Supplier Part Number 3: 08F9224; Supplier 4: Mouser; Supplier Part Number 4: 595-TL062ACD; Eco-Plan: Green (RoHS & no Sb/Br); Mounting Technology: Surface Mount; Code_JEDEC: MS-012; PartNumber: TL062ACD; ComponentLink1Description: Manufacturer URL; ComponentLink1URL: http://www.ti.com/; ComponentLink2Description: Datasheet; ComponentLink2URL: http://www.ti.com/lit/ds/symlink/tl062a.pdf; ComponentLink3Description: Package Specification; ComponentLink3URL: http://www.ti.com/litv/pdf/msoi002j
Y1#1 = XTAL: Crystal Oscillator; Published: 8-Jun-2000; LatestRevisionDate: 17-Jul-2002; LatestRevisionNote: Re-released for DXP Platform.; PackageReference: R38; Publisher: Altium Limited; PackageDescription: Crystal, Thru-Hole; 2 Leads; Body 3.1 x 8.2 mm (Dia.xH)

## Sheet dac.SchDoc: DAC
size A3; Author: wq; DrawnBy: wq; Organization: 合肥弗雷电子; Address1: 玉兰大道14号D栋3楼; Address2: 肥西县桃花镇; Address3: 合肥市; Address4: 安徽省; DocumentNumber: 1; Revision: betaV1.0; SheetNumber: 1; SheetTotal: 1
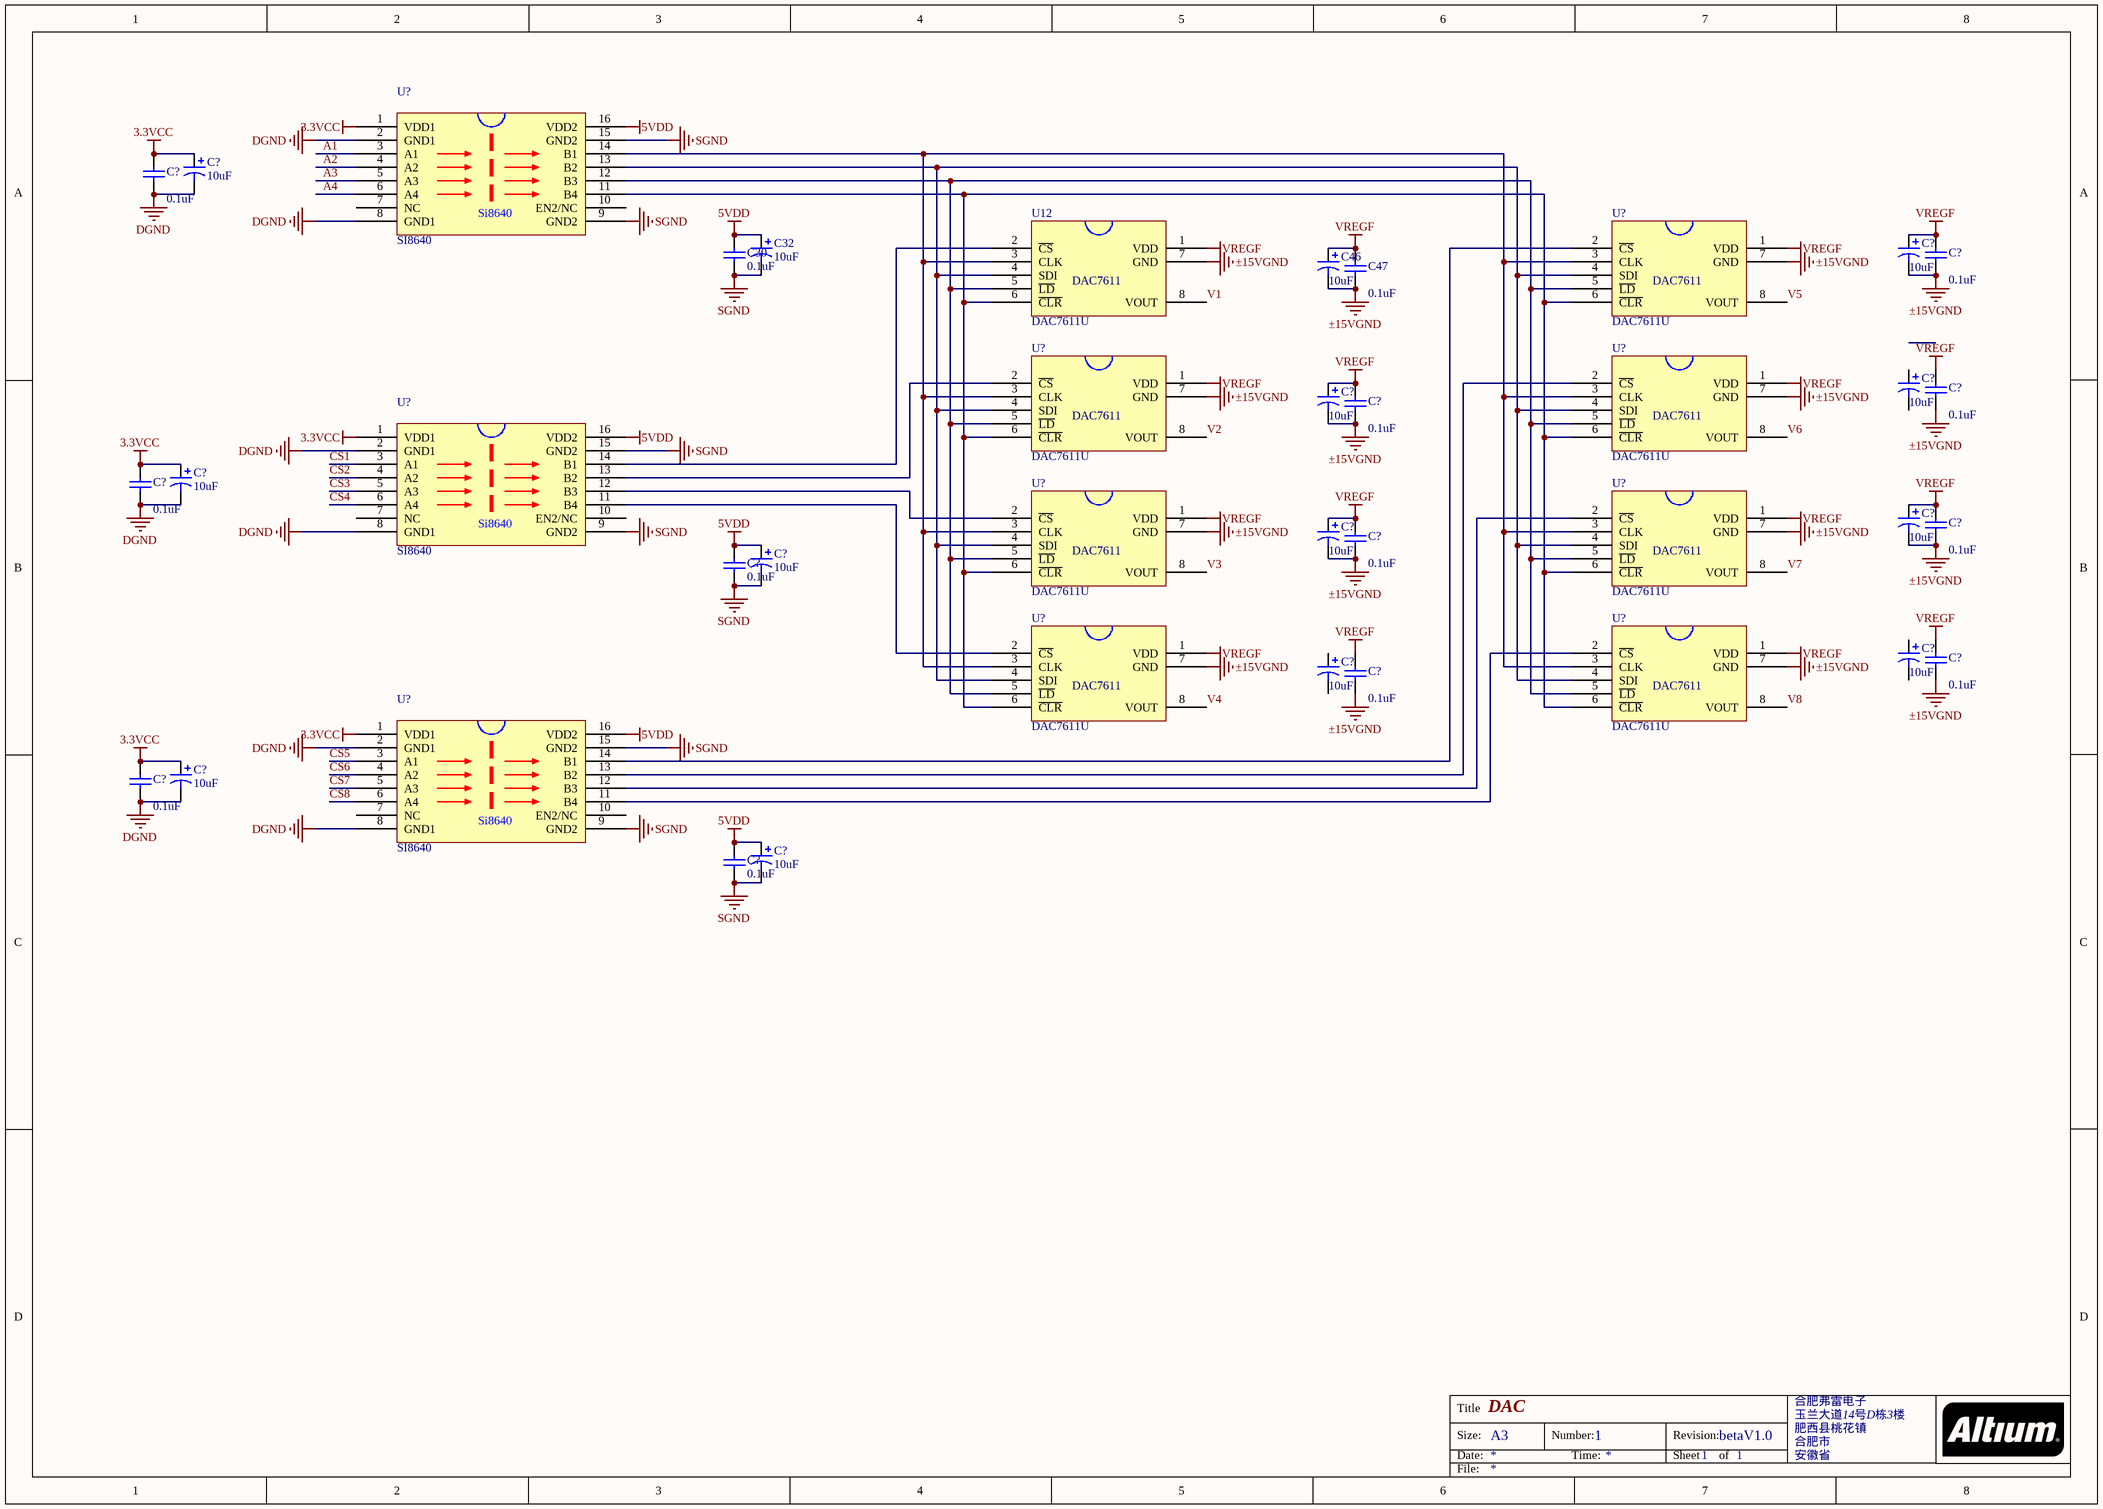
[diagram p1: dac.SchDoc]

### Parts
(Parts that share a designator on the sheet are numbered #1, #2 ... from top to bottom, then left to right.)
C30#2  value 0.1uF  [0805c]  (hidden comment: CC0805MRX7R9BB104)
C32#2  value 10uF  [CB]  (hidden comment: T494B106M006AHAUTO)
C46#2  value 10uF  [CB]  (hidden comment: T494B106M006AHAUTO)
C47#2  value 0.1uF  [0805c]  (hidden comment: CC0805MRX7R9BB104)
C?#1  value 0.1uF  [0805c]  (hidden comment: CC0805MRX7R9BB104)
C?#2  value 10uF  [CB]  (hidden comment: T494B106M006AHAUTO)
C?#3  value 10uF  [CB]  (hidden comment: T494B106M006AHAUTO)
C?#4  value 0.1uF  [0805c]  (hidden comment: CC0805MRX7R9BB104)
C?#5  value 10uF  [CB]  (hidden comment: T494B106M006AHAUTO)
C?#6  value 10uF  [CB]  (hidden comment: T494B106M006AHAUTO)
C?#7  value 0.1uF  [0805c]  (hidden comment: CC0805MRX7R9BB104)
C?#8  value 0.1uF  [0805c]  (hidden comment: CC0805MRX7R9BB104)
C?#9  value 0.1uF  [0805c]  (hidden comment: CC0805MRX7R9BB104)
C?#10  value 10uF  [CB]  (hidden comment: T494B106M006AHAUTO)
C?#11  value 10uF  [CB]  (hidden comment: T494B106M006AHAUTO)
C?#12  value 10uF  [CB]  (hidden comment: T494B106M006AHAUTO)
C?#13  value 0.1uF  [0805c]  (hidden comment: CC0805MRX7R9BB104)
C?#14  value 0.1uF  [0805c]  (hidden comment: CC0805MRX7R9BB104)
C?#15  value 0.1uF  [0805c]  (hidden comment: CC0805MRX7R9BB104)
C?#16  value 10uF  [CB]  (hidden comment: T494B106M006AHAUTO)
C?#17  value 10uF  [CB]  (hidden comment: T494B106M006AHAUTO)
C?#18  value 10uF  [CB]  (hidden comment: T494B106M006AHAUTO)
C?#19  value 0.1uF  [0805c]  (hidden comment: CC0805MRX7R9BB104)
C?#20  value 0.1uF  [0805c]  (hidden comment: CC0805MRX7R9BB104)
C?#21  value 0.1uF  [0805c]  (hidden comment: CC0805MRX7R9BB104)
C?#22  value 10uF  [CB]  (hidden comment: T494B106M006AHAUTO)
C?#23  value 0.1uF  [0805c]  (hidden comment: CC0805MRX7R9BB104)
C?#24  value 10uF  [CB]  (hidden comment: T494B106M006AHAUTO)
U12#2  DAC7611U  [so-8-n]
U?#1  SI8640
U?#2  DAC7611U  [so-8-n]
U?#3  DAC7611U  [so-8-n]
U?#4  DAC7611U  [so-8-n]
U?#5  SI8640
U?#6  DAC7611U  [so-8-n]
U?#7  DAC7611U  [so-8-n]
U?#8  DAC7611U  [so-8-n]
U?#9  DAC7611U  [so-8-n]
U?#10  SI8640

### Nets
3.3VCC: C?#1.1 C?#2.1 C?#9.1 C?#10.1 C?#21.1 C?#22.1 U?#1.1(VDD1) U?#5.1(VDD1) U?#10.1(VDD1)
5VDD: C30#2.1 C32#2.1 C?#15.1 C?#16.1 C?#23.1 C?#24.1 U?#1.16(VDD2) U?#5.16(VDD2) U?#10.16(VDD2)
DGND: C?#1.2 C?#2.2 C?#9.2 C?#10.2 C?#21.2 C?#22.2 U?#1.2(GND1) U?#1.8(GND1) U?#5.2(GND1) U?#5.8(GND1) U?#10.2(GND1) U?#10.8(GND1)  [project net 5VIN-]
SGND: C30#2.2 C32#2.2 C?#15.2 C?#16.2 C?#23.2 C?#24.2 U?#1.9(GND2) U?#1.15(GND2) U?#5.9(GND2) U?#5.15(GND2) U?#10.9(GND2) U?#10.15(GND2)
VREGF: C46#2.1 C47#2.2 C?#3.1 C?#4.2 C?#6.1 C?#7.2 C?#8.2 C?#11.1 C?#12.1 C?#13.2 C?#14.2 C?#19.2 C?#20.2 U12#2.1(VDD) U?#2.1(VDD) U?#3.1(VDD) U?#4.1(VDD) U?#6.1(VDD) U?#7.1(VDD) U?#8.1(VDD) U?#9.1(VDD)
±15VGND: C46#2.2 C47#2.1 C?#3.2 C?#4.1 C?#6.2 C?#7.1 C?#8.1 C?#11.2 C?#12.2 C?#13.1 C?#14.1 C?#19.1 C?#20.1 U12#2.7(GND) U?#2.7(GND) U?#3.7(GND) U?#4.7(GND) U?#6.7(GND) U?#7.7(GND) U?#8.7(GND) U?#9.7(GND)
A1: U?#1.3(A1)
A2: U?#1.4(A2)
A3: U?#1.5(A3)
A4: U?#1.6(A4)
CS1: U?#5.3(A1)
CS2: U?#5.4(A2)
CS3: U?#5.5(A3)
CS4: U?#5.6(A4)
CS5: U?#10.3(A1)
CS6: U?#10.4(A2)
CS7: U?#10.5(A3)
CS8: U?#10.6(A4)
V1: U12#2.8(VOUT)
V2: U?#3.8(VOUT)
V3: U?#6.8(VOUT)
V4: U?#8.8(VOUT)
V5: U?#2.8(VOUT)
V6: U?#4.8(VOUT)
V7: U?#7.8(VOUT)
V8: U?#9.8(VOUT)
NetU12#2_2: U12#2.2(~{CS}) U?#5.14(B1)
NetU12#2_3: U12#2.3(CLK) U?#1.14(B1) U?#2.3(CLK) U?#3.3(CLK) U?#4.3(CLK) U?#6.3(CLK) U?#7.3(CLK) U?#8.3(CLK) U?#9.3(CLK)
NetU12#2_4: U12#2.4(SDI) U?#1.13(B2) U?#2.4(SDI) U?#3.4(SDI) U?#4.4(SDI) U?#6.4(SDI) U?#7.4(SDI) U?#8.4(SDI) U?#9.4(SDI)
NetU12#2_5: U12#2.5(~{LD}) U?#1.12(B3) U?#2.5(~{LD}) U?#3.5(~{LD}) U?#4.5(~{LD}) U?#6.5(~{LD}) U?#7.5(~{LD}) U?#8.5(~{LD}) U?#9.5(~{LD})
NetU12#2_6: U12#2.6(~{CLR}) U?#1.11(B4) U?#2.6(~{CLR}) U?#3.6(~{CLR}) U?#4.6(~{CLR}) U?#6.6(~{CLR}) U?#7.6(~{CLR}) U?#8.6(~{CLR}) U?#9.6(~{CLR})
NetU?#2_2: U?#2.2(~{CS}) U?#10.14(B1)
NetU?#3_2: U?#3.2(~{CS}) U?#5.13(B2)
NetU?#4_2: U?#4.2(~{CS}) U?#10.13(B2)
NetU?#5_11: U?#5.11(B4) U?#8.2(~{CS})
NetU?#5_12: U?#5.12(B3) U?#6.2(~{CS})
NetU?#7_2: U?#7.2(~{CS}) U?#10.12(B3)
NetU?#9_2: U?#9.2(~{CS}) U?#10.11(B4)

Not connected (* = marked no-connect by the designer): C?#5 1 2; C?#17 1 2; C?#18 1 2; U?#1 7(NC) 10(EN2/NC); U?#5 7(NC) 10(EN2/NC); U?#10 7(NC) 10(EN2/NC)

### Notes on the sheet
- Title
- Size:
- Date:
- A3
- Number:
- Time:
- Revision:
- Sheet
- of
- File:
- (in symbol SI8640) Si8640

### Library data of the parts
C30#2 C47#2 C?#1 C?#4 C?#7-C?#9 C?#13-C?#15 C?#19-C?#21 C?#23 = Cap: Capacitor
  C30#2 C47#2 C?#4 C?#7 C?#8 C?#13-C?#15 C?#19 C?#20 C?#23: Published: 8-Jun-2000; LatestRevisionDate: 17-Jul-2002; LatestRevisionNote: Re-released for DXP Platform.; PackageReference: RAD-0.3; Publisher: Altium Limited; PackageDescription: Radial Cap, Thru-Hole; 2 Leads; 0.3 in Pin Spacing
C32#2 C46#2 C?#2 C?#3 C?#5 C?#6 C?#10-C?#12 C?#16-C?#18 C?#22 C?#24 = Cap Pol1: Polarized Capacitor (Radial); Published: 8-Jun-2000; LatestRevisionDate: 17-Jul-2002; LatestRevisionNote: Re-released for DXP Platform.; PackageReference: RB7.6-15; Publisher: Altium Limited; PackageDescription: Polarized Capacitor (Radial); 2 Leads
U12#2 U?#2-U?#4 U?#6-U?#9 = DAC7611